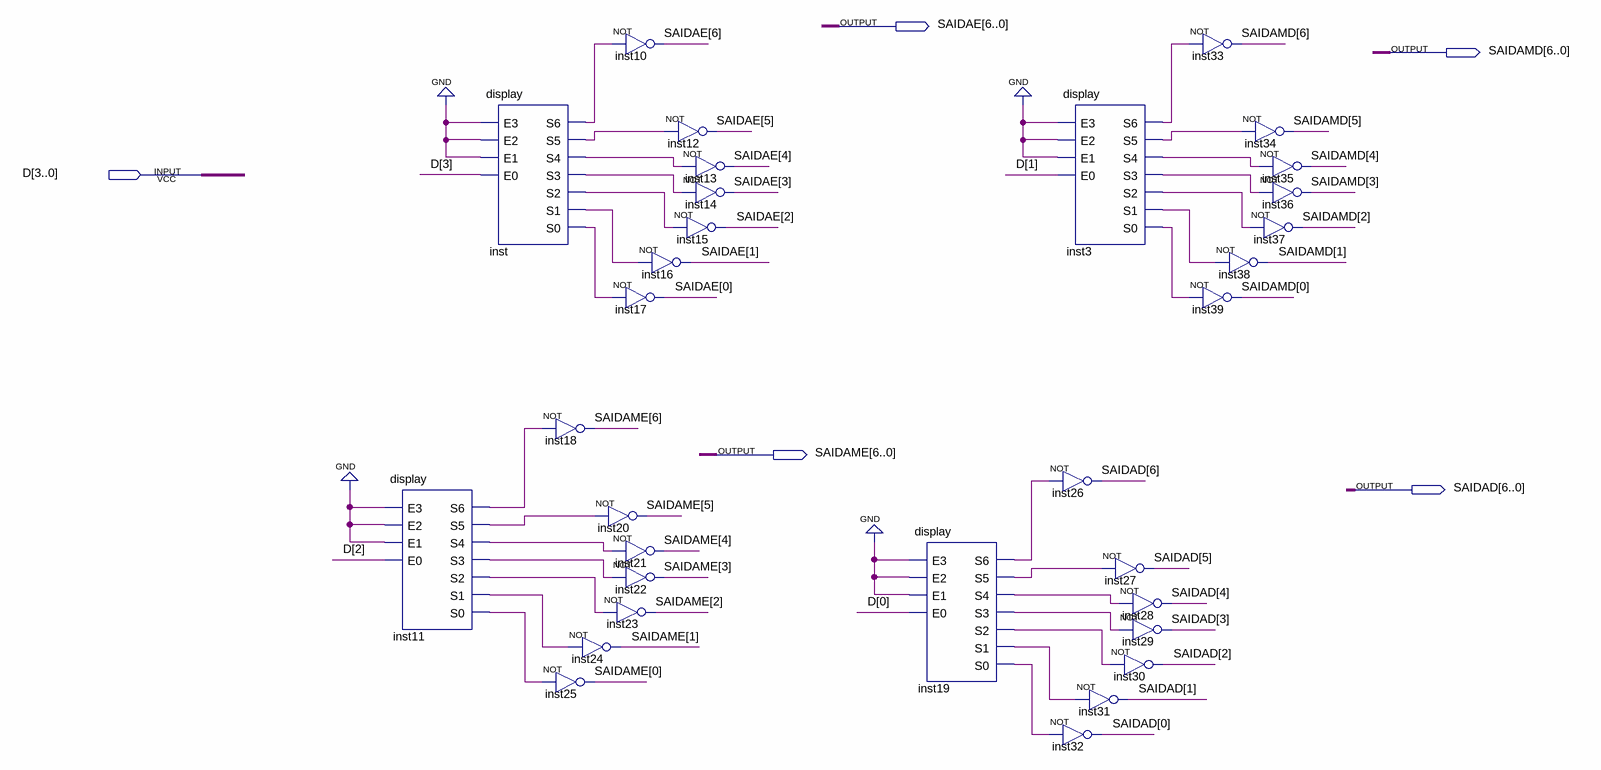
[diagram p0: schematic sheet]
// Quartus schematic display_todos.bdf as structural Verilog: 32 symbols, 5 pins
module display_todos (
  input  [3:0] D,
  output [6:0] SAIDAE,
  output [6:0] SAIDAMD,
  output [6:0] SAIDAME,
  output [6:0] SAIDAD
);

  wire inst3_s0, inst3_s1, inst3_s2, inst3_s3, inst3_s4, inst3_s5, inst3_s6, inst11_s0, inst11_s1, inst11_s2,
       inst11_s3, inst11_s4, inst11_s5, inst11_s6, inst19_s0, inst19_s1, inst19_s2, inst19_s3, inst19_s4,
       inst19_s5, inst19_s6, inst_s0, inst_s1, inst_s2, inst_s3, inst_s4, inst_s5, inst_s6;

  display inst11 (
    .E3(1'b0), .E2(1'b0), .E1(1'b0), .E0(D[2]), .S6(inst11_s6), .S5(inst11_s5), .S4(inst11_s4),
    .S3(inst11_s3), .S2(inst11_s2), .S1(inst11_s1), .S0(inst11_s0));
  display inst (
    .E3(1'b0), .E2(1'b0), .E1(1'b0), .E0(D[3]), .S6(inst_s6), .S5(inst_s5), .S4(inst_s4), .S3(inst_s3),
    .S2(inst_s2), .S1(inst_s1), .S0(inst_s0));
  not inst18 (SAIDAME[6], inst11_s6);
  not inst25 (SAIDAME[0], inst11_s0);
  not inst10 (SAIDAE[6], inst_s6);
  not inst17 (SAIDAE[0], inst_s0);
  not inst20 (SAIDAME[5], inst11_s5);
  not inst21 (SAIDAME[4], inst11_s4);
  not inst22 (SAIDAME[3], inst11_s3);
  not inst23 (SAIDAME[2], inst11_s2);
  not inst24 (SAIDAME[1], inst11_s1);
  not inst12 (SAIDAE[5], inst_s5);
  not inst13 (SAIDAE[4], inst_s4);
  not inst14 (SAIDAE[3], inst_s3);
  not inst15 (SAIDAE[2], inst_s2);
  not inst16 (SAIDAE[1], inst_s1);
  display inst19 (
    .E3(1'b0), .E2(1'b0), .E1(1'b0), .E0(D[0]), .S6(inst19_s6), .S5(inst19_s5), .S4(inst19_s4),
    .S3(inst19_s3), .S2(inst19_s2), .S1(inst19_s1), .S0(inst19_s0));
  display inst3 (
    .E3(1'b0), .E2(1'b0), .E1(1'b0), .E0(D[1]), .S6(inst3_s6), .S5(inst3_s5), .S4(inst3_s4), .S3(inst3_s3),
    .S2(inst3_s2), .S1(inst3_s1), .S0(inst3_s0));
  not inst26 (SAIDAD[6], inst19_s6);
  not inst27 (SAIDAD[5], inst19_s5);
  not inst31 (SAIDAD[1], inst19_s1);
  not inst32 (SAIDAD[0], inst19_s0);
  not inst28 (SAIDAD[4], inst19_s4);
  not inst29 (SAIDAD[3], inst19_s3);
  not inst30 (SAIDAD[2], inst19_s2);
  not inst33 (SAIDAMD[6], inst3_s6);
  not inst34 (SAIDAMD[5], inst3_s5);
  not inst38 (SAIDAMD[1], inst3_s1);
  not inst39 (SAIDAMD[0], inst3_s0);
  not inst35 (SAIDAMD[4], inst3_s4);
  not inst36 (SAIDAMD[3], inst3_s3);
  not inst37 (SAIDAMD[2], inst3_s2);
endmodule
